# EAGLE design W607B (EAGLE 6.6.0)
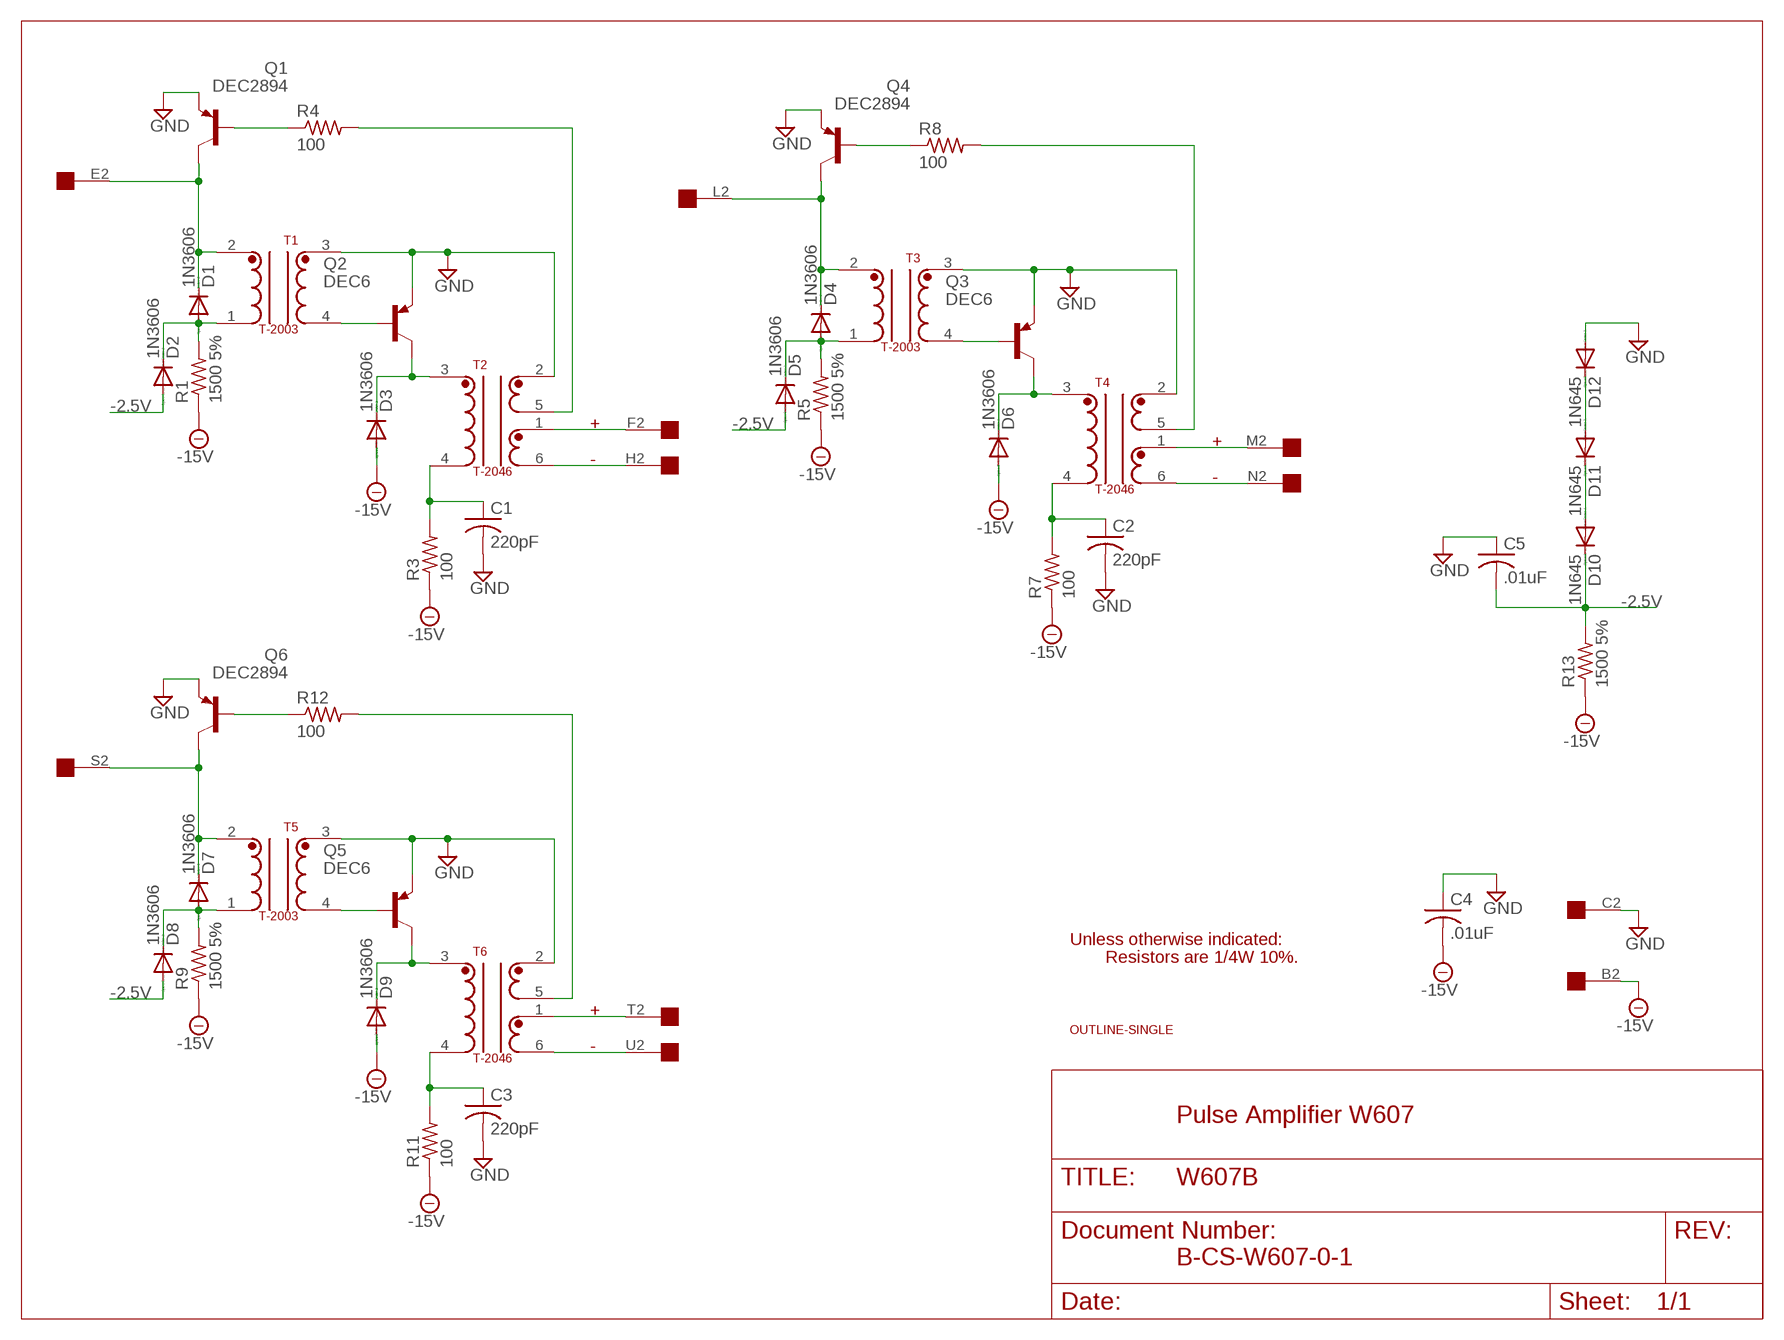
[diagram p0: schematic, sheet 1]

## Parts
C1  220pF  C-US050-025X075  [C050-025X075]
C2  220pF  C-US050-025X075  [C050-025X075]
C3  220pF  C-US050-025X075  [C050-025X075]
C4  .01uF  C-US050-025X075  [C050-025X075]
C5  .01uF  C-US050-025X075  [C050-025X075]
D1  1N3606  1N4148DO35-10  [DO35-10]
D2  1N3606  1N4148DO35-10  [DO35-10]
D3  1N3606  1N4148DO35-10  [DO35-10]
D4  1N3606  1N4148DO35-10  [DO35-10]
D5  1N3606  1N4148DO35-10  [DO35-10]
D6  1N3606  1N4148DO35-10  [DO35-10]
D7  1N3606  1N4148DO35-10  [DO35-10]
D8  1N3606  1N4148DO35-10  [DO35-10]
D9  1N3606  1N4148DO35-10  [DO35-10]
D10  1N645  1N4148DO35-10  [DO35-10]
D11  1N645  1N4148DO35-10  [DO35-10]
D12  1N645  1N4148DO35-10  [DO35-10]
Q1  DEC2894  2N2904  [TO39]
Q2  DEC6  2N2904  [TO39]
Q3  DEC6  2N2904  [TO39]
Q4  DEC2894  2N2904  [TO39]
Q5  DEC6  2N2904  [TO39]
Q6  DEC2894  2N2904  [TO39]
R1  1500 5%  R-US_0207/10  [0207/10]
R3  100  R-US_0207/10  [0207/10]
R4  100  R-US_0207/10  [0207/10]
R5  1500 5%  R-US_0207/10  [0207/10]
R7  100  R-US_0207/10  [0207/10]
R8  100  R-US_0207/10  [0207/10]
R9  1500 5%  R-US_0207/10  [0207/10]
R11  100  R-US_0207/10  [0207/10]
R12  100  R-US_0207/10  [0207/10]
R13  1500 5%  R-US_0207/10  [0207/10]
T1  T-2003  T-2010  [TRANSFORMER2]
T2  T-2046  [TRANSFORMER6]
T3  T-2003  T-2010  [TRANSFORMER2]
T4  T-2046  [TRANSFORMER6]
T5  T-2003  T-2010  [TRANSFORMER2]
T6  T-2046  [TRANSFORMER6]
U$1  OUTLINE-SINGLE  [SINGLE]
U$2  EDGE-1  [EDGE-CON1]

## Nets
-2.5V: C5.2 D2.A D5.A D8.A D10.C R13.2
-15V: C4.2 D3.A D6.A D9.A R1.1 R3.1 R5.1 R7.1 R9.1 R11.1 R13.1 U$2.B2
GND [Supply]: C1.2 C2.2 C3.2 C4.1 C5.1 D12.A Q1.1(E) Q2.1(E) Q3.1(E) Q4.1(E) Q5.1(E) Q6.1(E) T1.3 T2.2 T3.3 T4.2 T5.3 T6.2 U$2.C2
N$1: C1.1 R3.2 T2.4
N$3: D1.C Q1.3(C) T1.2 U$2.E2
N$4: D1.A D2.C R1.2 T1.1
N$5: Q1.2(B) R4.1
N$6: Q2.2(B) T1.4
N$7: R4.2 T2.5
N$8: D4.C Q4.3(C) T3.2 U$2.L2
N$9: D4.A D5.C R5.2 T3.1
N$10: T2.1 U$2.F2
N$11: Q3.2(B) T3.4
N$12: T2.6 U$2.H2
N$13: D3.C Q2.3(C) T2.3
N$14: D6.C Q3.3(C) T4.3
N$16: C2.1 R7.2 T4.4
N$17: Q4.2(B) R8.1
N$18: R8.2 T4.5
N$19: T4.1 U$2.M2
N$20: T4.6 U$2.N2
N$21: D7.C Q6.3(C) T5.2 U$2.S2
N$22: D7.A D8.C R9.2 T5.1
N$23: Q5.2(B) T5.4
N$24: D9.C Q5.3(C) T6.3
N$26: C3.1 R11.2 T6.4
N$27: Q6.2(B) R12.1
N$28: R12.2 T6.5
N$29: T6.1 U$2.T2
N$30: T6.6 U$2.U2
N$31: D11.A D12.C
N$32: D10.A D11.C
Unconnected: U$2.A2 U$2.D2 U$2.J2 U$2.K2 U$2.P2 U$2.R2 U$2.V2

## Notes on the sheet
- +
- +
- -
- -
- Unless otherwise indicated:
- Resistors are 1/4W 10%.
- +
- -
- Pulse Amplifier W607
- B-CS-W607-0-1

## Library data of the parts
C1-C5 = rcl:C-US: CAPACITOR, American symbol
D1-D12 = diode:1N4148: DIODE high speed (Philips)
Q1-Q6 = transistor-pnp:2N2904*: PNP Transistror
R1 R3-R5 R7-R9 R11-R13 = rcl:R-US_: RESISTOR, American symbol
T1 T3 T5 = dec-con:T-2010: Button Transformer
T2 T4 T6 = dec-con:T-2046: T-2046 Transformer
U$1 = dec-con:OUTLINE-*: Board outlines for DEC boards.
U$2 = dec-con:EDGE-1: Single-Sided DEC Edge Connector -- (side 2)

## Net classes
1 Supply: width 0.813 mm

## Board
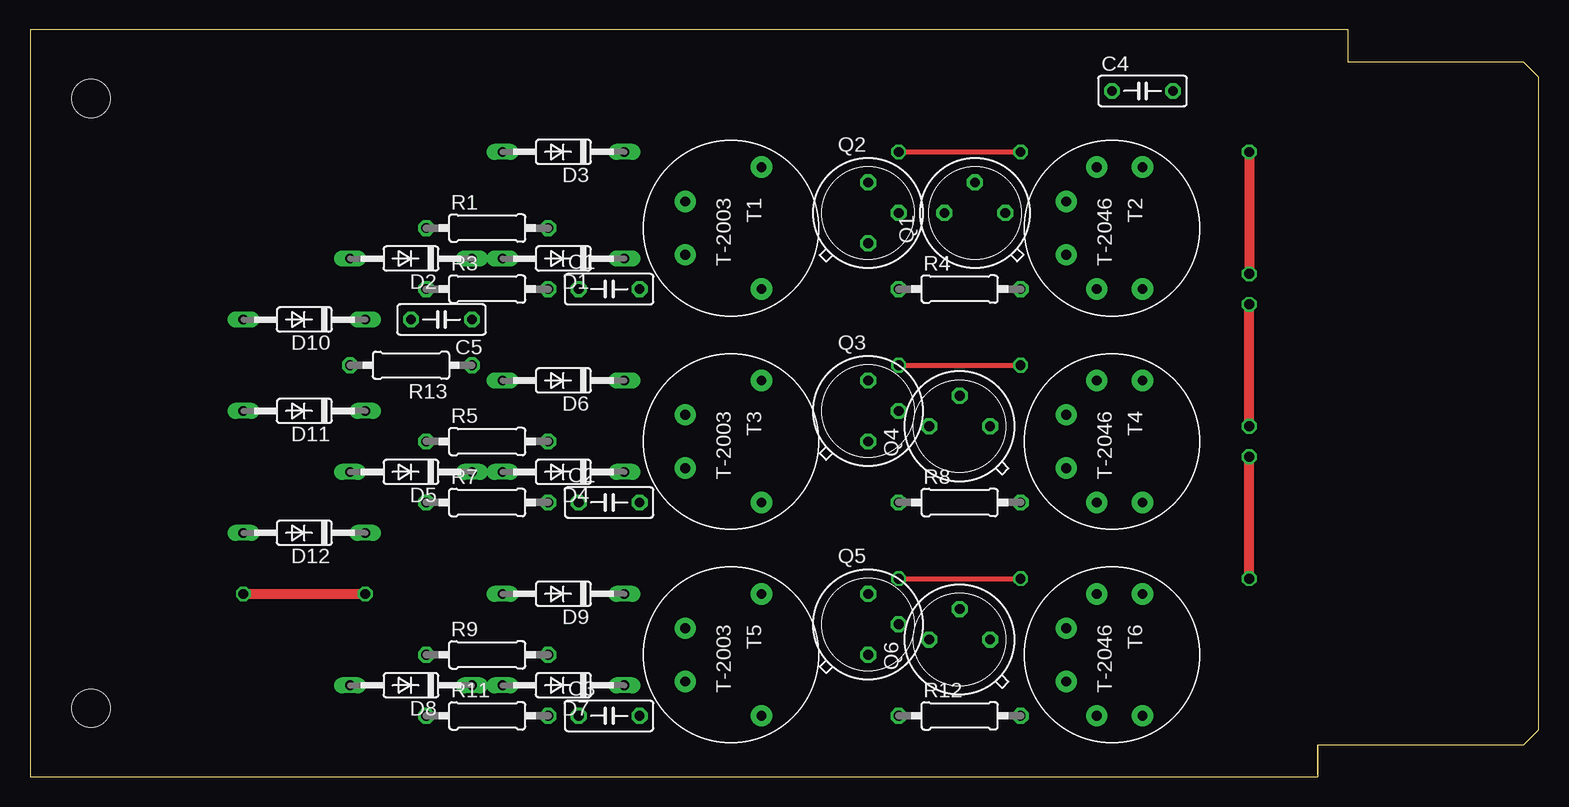
[diagram p1: board, top side]
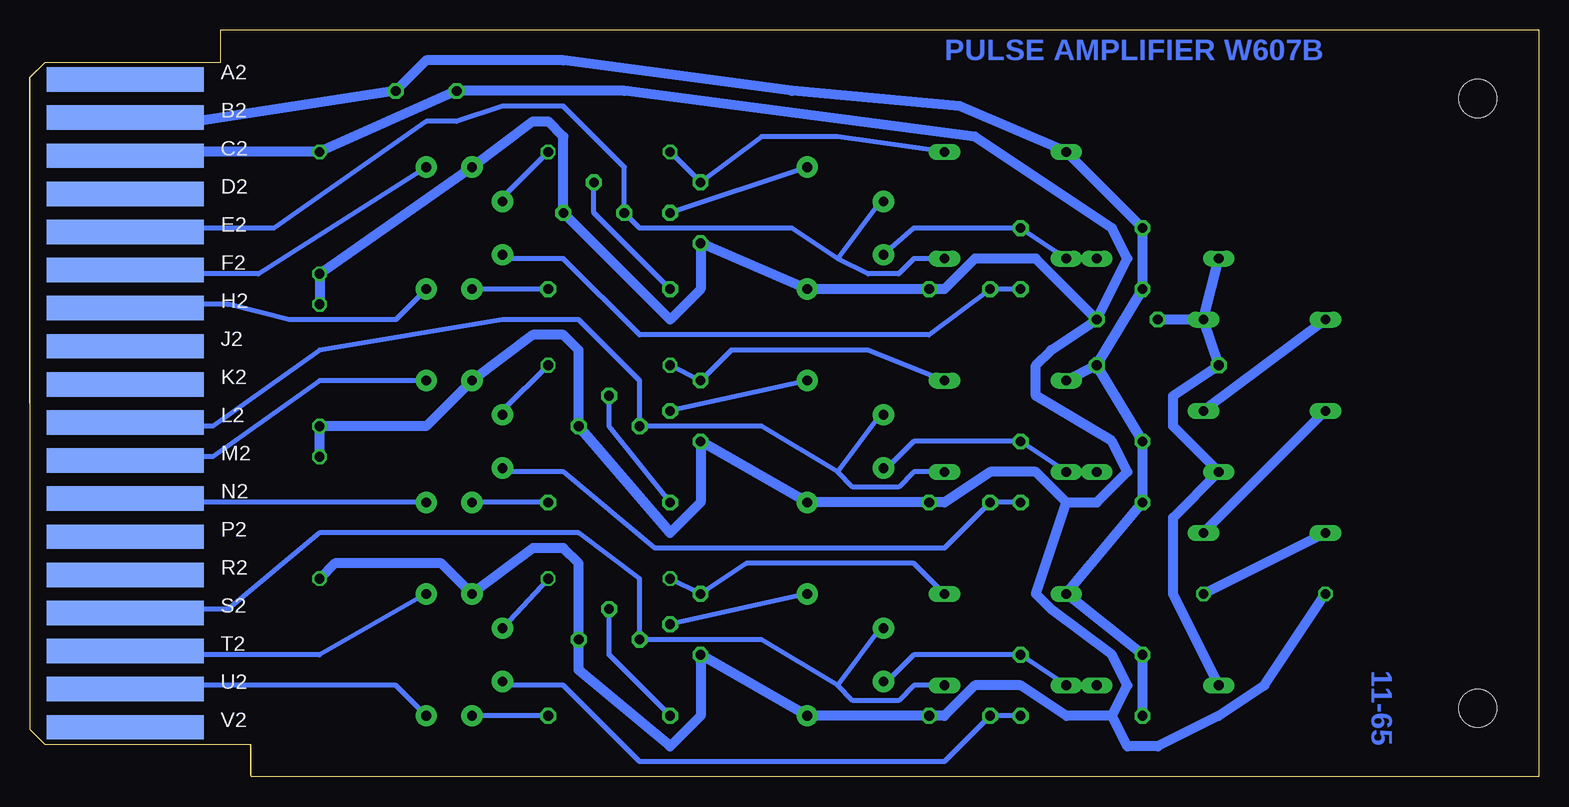
[diagram p2: board, bottom side, seen from below]

Size 125.73 x 62.23 mm. Coordinates in mm from the lower left corner, seen from the top.
Copper layers (1+16): Top 0.035mm / dielectric 1.5mm / Bottom 0.035mm
Design rules "16mils": minimum track width 16mil, minimum drill 32mil, track to track 15mil, track to pad 10mil, pad to pad 10mil, via to via 10mil, smd to smd 10mil, copper to edge 13mil, drill to drill 10mil, minimum pad ring 10mil, minimum via ring 8mil, stop-mask expansion 0mil, vias tented up to drill 0mil, thermal gap 10mil

### Footprints (pad centres in the part's own frame; a part is rotated, then mirrored left to right if it is on the bottom)
C050-025X075 = drill 0.813 octagon: 1 -2.54,0; 2 2.54,0
DO35-10 = drill 0.813 long: A 5.08,0; C -5.08,0
TO39 = drill 0.813 octagon: 1 0,-2.54; 2 2.54,0; 3 0,2.54
0207/10 = drill 0.813 octagon: 1 -5.08,0; 2 5.08,0
TRANSFORMER2 = drill 0.813 pad 1.778: 1 2.223,-3.81; 2 -2.223,-3.81; 3 5.08,2.54; 4 -5.08,2.54
TRANSFORMER6 = drill 0.813 pad 1.778: 1 -5.08,2.54; 2 -5.08,-1.27; 3 -2.223,-3.81; 4 2.223,-3.81; 5 5.08,-1.27; 6 5.08,2.54
SINGLE = hole 3.175: 120.65,56.515; 120.65,5.715
EDGE-CON1 = smd 13.106 x 2.032 bottom: A2 7.938,4.128; B2 7.938,7.303; C2 7.938,10.477; D2 7.938,13.652; E2 7.938,16.828; F2 7.938,20.003; H2 7.938,23.177; J2 7.938,26.352; K2 7.938,29.527; L2 7.938,32.703; M2 7.938,35.877; N2 7.938,39.053; P2 7.938,42.227; R2 7.938,45.403; S2 7.938,48.578; T2 7.938,51.752; U2 7.938,54.928; V2 7.938,58.102

### Placement (x,y rotation side)
C1  48.26,40.64 0 top
C2  48.26,22.86 0 top
C3  48.26,5.08 0 top
C4  92.71,57.15 0 top
C5  34.29,38.1 180 top
D1  44.45,43.18 180 top
D2  31.75,43.18 180 top
D3  44.45,52.07 180 top
D4  44.45,25.4 180 top
D5  31.75,25.4 180 top
D6  44.45,33.02 180 top
D7  44.45,7.62 180 top
D8  31.75,7.62 180 top
D9  44.45,15.24 180 top
D10  22.86,38.1 180 top
D11  22.86,30.48 180 top
D12  22.86,20.32 180 top
Q1  78.74,46.99 90 top
Q2  69.85,46.99 0 top
Q3  69.85,30.48 0 top
Q4  77.47,29.21 90 top
Q5  69.85,12.7 0 top
Q6  77.47,11.43 90 top
R1  38.1,45.72 0 top
R3  38.1,40.64 0 top
R4  77.47,40.64 0 top
R5  38.1,27.94 0 top
R7  38.1,22.86 0 top
R8  77.47,22.86 0 top
R9  38.1,10.16 0 top
R11  38.1,5.08 0 top
R12  77.47,5.08 0 top
R13  31.75,34.29 180 top
T1  58.42,45.72 270 top
T2  90.17,45.72 270 top
T3  58.42,27.94 270 top
T4  90.17,27.94 270 top
T5  58.42,10.16 270 top
T6  90.17,10.16 270 top
U$1  125.73,62.23 180 top
U$2  125.73,62.23 180 top

### Tracks (layer width: path | path; a pad name or v marks a point on that pad's centre or on a via)
-2.5V
  Bottom 0.813: D8.A 30.48,15.24 30.48,21.59 D5.A 30.48,29.21 30.48,31.75 R13.2 D10.C | D10.C D2.A | D10.C C5.2
-15V
  Bottom 0.813: U$2.B2 117.13,54.9 116.84,54.61 111.76,54.61 C4.2 92.71,59.69 81.28,59.69 62.23,57.15 48.26,55.88 D3.A R1.1 R3.1 R13.1 | R13.1 D6.A | R13.1 R5.1 R7.1 D9.A R9.1 R11.1
GND  (via drill 0.81)
  Top 0.813: v17.78,15.24 v27.94,15.24 | v101.6,52.07 v101.6,41.91 | v101.6,29.21 v101.6,39.37 | v101.6,16.51 v101.6,26.67
  Bottom 0.813: U$2.C2 115.57,52.07 v101.6,52.07 C4.1 76.2,57.15 46.99,53.34 35.56,45.72 34.29,43.18 C5.1 | C5.1 40.64,35.56 41.91,34.29 41.91,31.75 35.56,27.94 34.29,25.4 36.83,22.86 39.37,22.86 | 39.37,22.86 41.91,25.4 45.72,25.4 49.53,22.86 C2.2 T3.3 Q3.1 69.85,22.86 72.39,20.32 Q4.1 80.01,35.56 81.28,36.83 83.82,36.83 T4.2 92.71,29.21 v101.6,29.21 v101.6,26.67 | v27.94,15.24 D12.A | v17.78,15.24 22.86,7.62 26.67,5.08 31.75,2.54 34.29,2.54 35.56,5.08 | 35.56,5.08 34.29,7.62 35.56,10.16 40.64,13.97 41.91,15.24 39.37,22.86 | 35.56,5.08 39.37,5.08 43.18,7.62 46.99,7.62 49.53,5.08 C3.2 T5.3 Q5.1 69.85,5.08 72.39,2.54 80.01,8.89 Q6.1 80.01,17.78 81.28,19.05 83.82,19.05 T6.2 91.44,17.78 100.33,17.78 v101.6,16.51 | v101.6,39.37 v101.6,41.91 T2.2 83.82,54.61 82.55,54.61 81.28,53.34 Q1.1 72.39,38.1 69.85,40.64 Q2.1 T1.3 C1.2 49.53,40.64 46.99,43.18 41.91,43.18 C5.1
N$1
  Bottom 0.406: R3.2 C1.1 50.8,36.83 74.93,36.83 81.28,43.18 86.36,43.18 T2.4
N$3
  Bottom 0.406: D1.C 52.07,43.18 53.34,41.91 55.88,41.91 58.42,43.18 | T1.2 54.61,48.26 58.42,43.18 | 58.42,43.18 62.23,45.72 74.93,45.72 Q1.3 76.2,50.8 81.28,55.88 86.36,55.88 90.17,54.61 92.71,54.61 105.41,45.72 116.84,45.72 U$2.E2
N$4
  Bottom 0.406: D2.C D1.A R1.2 52.07,45.72 T1.1
N$5
  Bottom 0.406: R4.1 78.74,46.99 Q1.2
N$6
  Bottom 0.406: T1.4 Q2.2
N$7
  Bottom 0.406: R4.2 T2.5
N$8
  Bottom 0.406: D4.C 52.07,25.4 53.34,24.13 57.15,24.13 58.42,25.4 | T3.2 54.61,30.48 58.42,25.4 | 58.42,25.4 64.77,29.21 Q4.3 74.93,33.02 80.01,38.1 86.36,38.1 101.6,35.56 110.49,29.21 116.84,29.21 U$2.L2
N$9
  Bottom 0.406: D5.C D4.A R5.2 52.07,27.94 54.61,25.4 T3.1
N$10
  Bottom 0.406: U$2.F2 116.84,41.91 106.68,41.91 T2.1
N$11
  Bottom 0.406: T3.4 Q3.2
N$12
  Bottom 0.406: U$2.H2 116.84,39.37 109.22,39.37 104.14,38.1 95.25,38.1 T2.6
N$13  (via drill 0.81)
  Top 0.406: v72.39,52.07 v82.55,52.07
  Bottom 0.406: D3.C 58.42,53.34 64.77,53.34 Q2.3 v72.39,52.07 | T2.3 86.36,48.26 v82.55,52.07
N$14  (via drill 0.81)
  Top 0.406: v72.39,34.29 v82.55,34.29
  Bottom 0.406: v72.39,34.29 Q3.3 67.31,35.56 55.88,35.56 D6.C | T4.3 86.36,30.48 v82.55,34.29
N$16
  Bottom 0.406: R7.2 C2.1 49.53,19.05 73.66,19.05 81.28,25.4 86.36,25.4 T4.4
N$17
  Bottom 0.406: R8.1 77.47,29.21 Q4.2
N$18
  Bottom 0.406: R8.2 T4.5
N$19
  Bottom 0.406: U$2.M2 116.84,26.67 110.49,26.67 101.6,33.02 T4.1
N$20
  Bottom 0.406: U$2.N2 116.84,22.86 T4.6
N$21
  Bottom 0.406: D7.C 52.07,7.62 53.34,6.35 57.15,6.35 58.42,7.62 | T5.2 54.61,12.7 58.42,7.62 | 58.42,7.62 64.77,11.43 Q6.3 74.93,16.51 80.01,20.32 101.6,20.32 109.22,13.97 116.84,13.97 U$2.S2
N$22
  Bottom 0.406: D8.C D7.A R9.2 52.07,10.16 54.61,7.62 T5.1
N$23
  Bottom 0.406: T5.4 Q5.2
N$24  (via drill 0.81)
  Top 0.406: v72.39,16.51 v82.55,16.51
  Bottom 0.406: v82.55,16.51 T6.3 | v72.39,16.51 Q5.3 66.04,17.78 52.07,17.78 D9.C
N$26
  Bottom 0.406: R11.2 C3.1 49.53,1.27 74.93,1.27 81.28,7.62 86.04,7.62 T6.4
N$27
  Bottom 0.406: R12.1 77.47,10.16 Q6.2
N$28
  Bottom 0.406: R12.2 T6.5
N$29
  Bottom 0.406: U$2.T2 117.71,10.16 101.6,10.16 T6.1
N$30
  Bottom 0.406: U$2.U2 117.68,7.62 95.25,7.62 T6.6
N$31
  Bottom 0.813: D11.A D12.C
N$32
  Bottom 0.813: D10.A D11.C

### Text on the board
Bottom: PULSE AMPLIFIER W607B | 11-65